# EAGLE design true-bypass-2.0 (EAGLE 7.3.0)
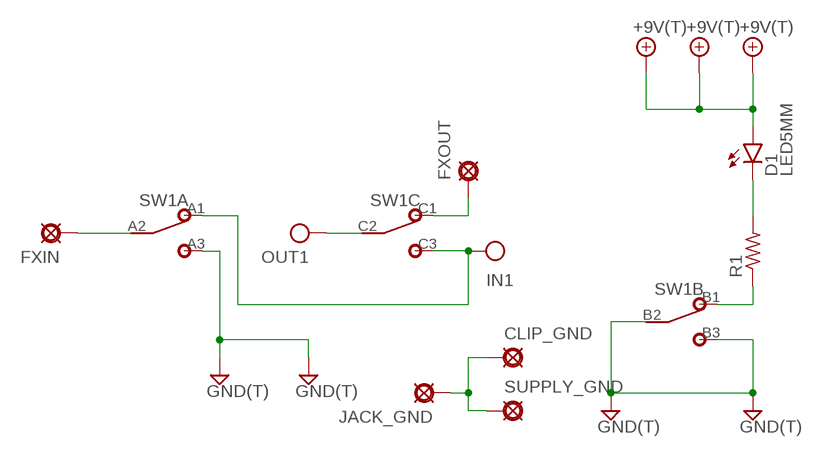
[diagram p0: schematic, sheet 1]

## Parts
+9V1  +9V(T)  [SQUARE]
+9V2  +9V(T)  [SQUARE]
+9V3  +9V(T)  [SQUARE]
CLIP_GND  PAD  [SQUARE]
D1  LED5MM  [LED5MM]
FXIN  PAD  [SQUARE]
FXOUT  PAD  [SQUARE]
GND1  GND(T)  [SQUARE]
GND3  GND(T)  [SQUARE]
GND4  GND(T)  [SQUARE]
GND5  GND(T)  [SQUARE]
IN1  IN(T)  [SQUARE]
JACK_GND  PAD  [SQUARE]
OUT1  OUT(T)  [SQUARE]
R1  6MM.3  [R0207/3]
SUPPLY_GND  PAD  [SQUARE]
SW1  3PDTBLUE  [CHINABLUE]

## Nets
+9V: +9V1.1(+9V) +9V2.1(+9V) +9V3.1(+9V) D1.A
GND: GND1.1(GND) GND3.1(GND) GND4.1(GND) GND5.1(GND) SW1.A3 SW1.B2 SW1.B3
IN: IN1.1(IN) SW1.A1 SW1.C3
N$1: FXIN.1(PAD) SW1.A2
N$2: D1.K(C) R1.2
N$3: R1.1 SW1.B1
N$4: FXOUT.1(PAD) SW1.C1
N$5: CLIP_GND.1(PAD) JACK_GND.1(PAD) SUPPLY_GND.1(PAD)
OUT: OUT1.1(OUT) SW1.C2

## Library data of the parts
+9V1-+9V3 = gm-supply:+9V(T): +9V Voltage Supply use this to hook up +9v throughout a schematic instead of running wire automatically labels the net "+9v" adds a hookup pad to the circuit board
CLIP_GND FXIN FXOUT JACK_GND SUPPLY_GND = gm-supply:PAD: PAD use this package for pads with any purpose, including input, output, send or return various pad shapes: round, square, octogonal, long, and long offset
D1 = gm-diodes:LED
GND1 GND3-GND5 = gm-supply:GND(T): Ground use this to hook up ground (GND) throughout a schematic instead of running wire automatically labels the net "GND" adds a hookup pad to the circuit board (you can use several)
IN1 = gm-supply:IN(T): Input obsolete: use Pad instead and label net shematic input label with circuit board terminal/pad generally used only once on a schematic (because this device labels the net "IN" in the same way as a voltage supply or ground net)
OUT1 = gm-supply:OUT(T): Output obsolete: use Pad instead and label net output label with circuit board terminal/pad usually appears only once on a schematic
R1 = gm-resistors:6MM: 6mm Resistors Leads spaced 1-6 holes apart for 0.1" perfboard. Suitable for 1/4 watt resistors.
SW1 = gm-switches:3PDT

## Board
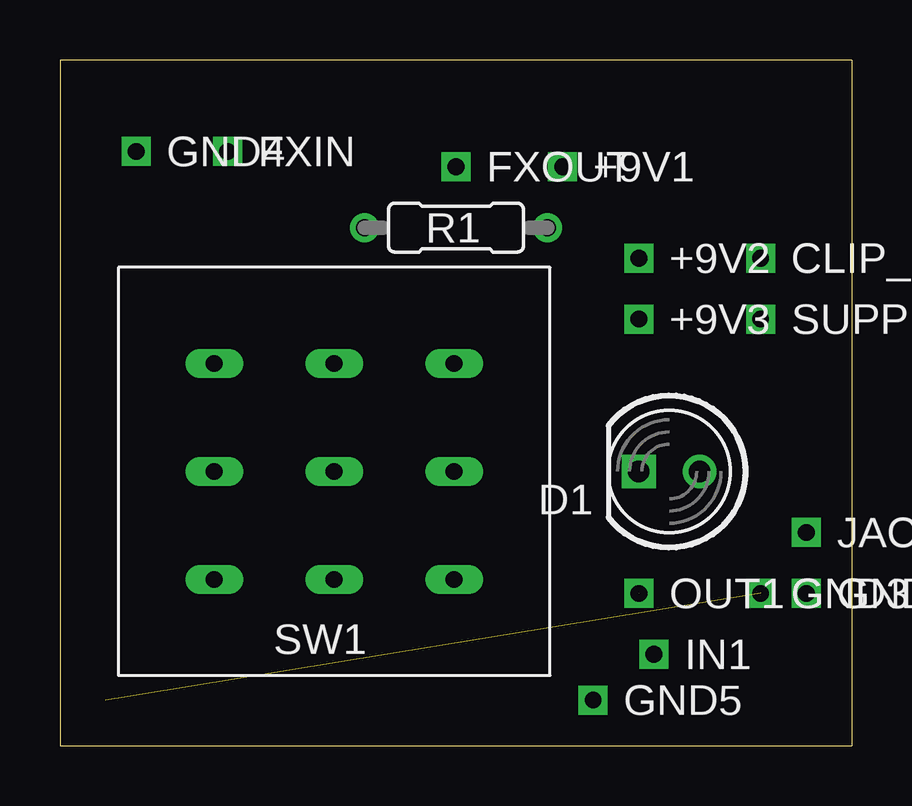
[diagram p1: board, top side]
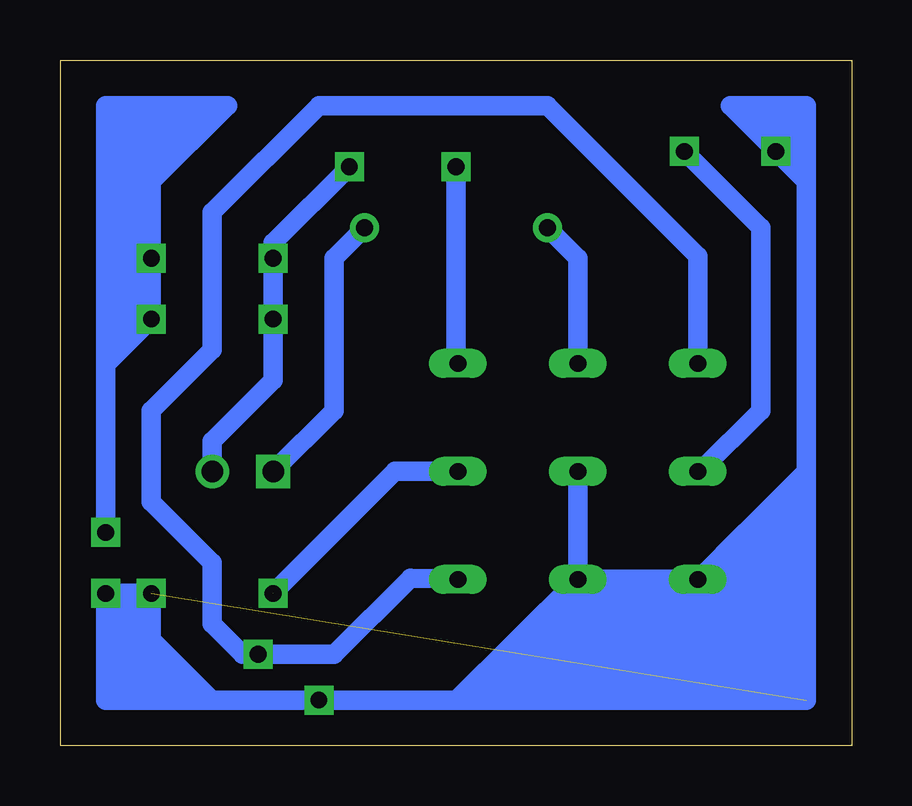
[diagram p2: board, bottom side, seen from below]

Size 33.02 x 28.57 mm. Coordinates in mm from the lower left corner, seen from the top.
Outline: 0,0 33.02,0 33.02,28.57 0,28.57 0,0
Copper layers (1*16): Top 0.035mm / dielectric 1.5mm / Bottom 0.035mm
Design rules "default": minimum track width 10mil, minimum drill 24mil, track to track 8mil, track to pad 8mil, pad to pad 8mil, via to via 8mil, smd to smd 8mil, copper to edge 40mil, drill to drill 8mil, minimum pad ring 10mil, minimum via ring 8mil, stop-mask expansion 4mil, vias tented up to drill 0mil, thermal gap 10mil

### Footprints (pad centres in the part's own frame; a part is rotated, then mirrored left to right if it is on the bottom)
SQUARE = drill 0.7 square: 1 0,0
LED5MM = drill 0.9: A -1.27,0 | drill 0.9 square: K 1.27,0
R0207/3 = drill 0.7: 1 -3.81,0; 2 3.81,0
CHINABLUE = drill 0.7 long: A1 -5,4.5; A2 -5,0; A3 -5,-4.5; B1 0,4.5; B2 0,0; B3 0,-4.5; C1 5,4.5; C2 5,0; C3 5,-4.5

### Placement (x,y rotation side)
+9V1  20.95,24.13 0 top
+9V2  24.13,20.32 0 top
+9V3  24.13,17.78 0 top
CLIP_GND  29.21,20.32 0 top
D1  25.4,11.43 180 top
FXIN  6.99,24.77 0 top
FXOUT  16.51,24.13 0 top
GND1  31.11,6.35 0 top
GND3  29.21,6.35 0 top
GND4  3.17,24.77 0 top
GND5  22.23,1.91 0 top
IN1  24.77,3.81 0 top
JACK_GND  31.11,8.89 0 top
OUT1  24.13,6.35 0 top
R1  16.51,21.59 0 top
SUPPLY_GND  29.21,17.78 0 top
SW1  11.43,11.43 0 top

### Tracks (layer width: path | path; a pad name or v marks a point on that pad's centre or on a via)
+9V
  Bottom 0.813: D1.A 26.67,12.7 24.13,15.24 +9V3.1 +9V2.1 24.13,20.95 +9V1.1
GND  (1 unrouted)
  Bottom 0.813: SW1.B2 SW1.B3 | SW1.A3 SW1.B3 | 26.67,1.91 GND5.1 16.51,1.91 | SW1.B3 16.51,1.91 | 27.3,1.91 31.11,1.91 GND1.1 GND3.1 29.21,4.45 26.67,1.91 | 16.51,1.91 6.35,1.91 | 6.35,5.71 6.35,6.35 11.43,6.35 15.24,2.54 6.99,2.54 6.99,5.71 10.79,5.71 11.43,5.08 | 11.43,5.08 12.06,5.08 13.97,3.17 7.62,3.17 7.62,5.08 10.79,5.08 | 10.79,5.08 11.43,5.71 11.43,5.08 | 11.43,5.08 12.7,3.81 8.26,3.81 8.26,4.45 11.43,4.45 10.79,5.08 | 5.71,6.99 4.45,6.99 | 4.45,6.99 3.81,6.99 3.81,6.35 | 3.81,1.91 6.35,1.91 | 6.35,1.91 6.35,5.71 | 6.35,5.71 5.71,6.35 4.45,6.35 | 4.45,6.35 4.45,2.54 5.08,2.54 | 5.08,2.54 5.71,2.54 5.71,5.71 5.08,5.71 5.08,2.54 | 1.91,23.5 GND4.1 5.08,26.67 1.91,26.67 1.91,26.04 | 1.91,23.5 1.91,11.43 | 1.91,11.43 1.91,8.26 | 1.91,8.26 2.54,8.26 | 2.54,8.26 4.45,6.35 | 1.91,26.04 1.91,24.13 | 1.91,23.5 1.91,24.13 | 1.91,24.13 3.81,26.04 1.91,26.04 | 1.91,26.04 2.54,25.4 | 1.91,8.26 1.91,1.91 3.81,1.91 | 3.81,1.91 3.81,6.35 | 3.81,6.35 2.54,7.62 2.54,2.54 3.17,2.54 3.17,6.35 | 4.45,7.62 4.45,8.89 | 4.45,8.89 1.91,11.43 | 4.45,8.89 6.35,6.99 5.71,6.99 | 5.71,6.99 2.54,10.16 2.54,9.53 | 2.54,9.53 2.54,8.26 | 2.54,8.26 3.17,8.26 4.45,6.99 | 4.45,6.99 4.45,7.62 | 4.45,7.62 2.54,9.53 | 26.67,1.91 27.3,1.91 | 27.3,1.91 29.21,3.81 29.21,3.17 28.57,2.54 30.48,2.54
IN
  Bottom 0.813: SW1.A1 6.43,20.4 12.7,26.67 22.23,26.67 26.67,22.23 26.67,16.51 29.21,13.97 29.21,10.16 26.67,7.62 26.67,5.08 25.4,3.81 IN1.1 21.59,3.81 18.41,6.99 SW1.C3
N$1
  Bottom 0.813: SW1.A2 6.35,11.43 3.81,13.97 3.81,21.59 FXIN.1
N$2
  Bottom 0.813: R1.2 21.59,20.32 21.59,13.97 D1.K
N$3
  Bottom 0.813: R1.1 11.43,20.32 SW1.B1
N$4
  Bottom 0.813: FXOUT.1 16.51,16.01 SW1.C1
N$5
  Bottom 0.813: 31.11,15.88 SUPPLY_GND.1 CLIP_GND.1 29.21,23.5 26.04,26.67 27.3,26.67 | 31.11,15.88 JACK_GND.1 | 31.11,15.88 31.11,26.67 27.3,26.67 | 27.3,26.67 27.3,26.04 28.57,24.77
N$6
  Bottom 0.813: 30.48,17.14 30.48,26.04 27.94,26.04 27.94,25.4 29.84,23.5 | 29.84,23.5 29.84,24.13 | 29.84,24.13 29.84,25.4 28.57,25.4 29.84,24.13 | 29.84,23.5 29.84,17.78
N$7
  Bottom 0.813: 29.84,5.71 30.48,5.71 30.48,3.17 29.84,3.17 29.84,5.71
OUT  (1 unrouted)
  Bottom 0.813: SW1.C2 19.05,11.43 OUT1.1